# Altium schematic sheet UART_CH340E.SchDoc
size A4
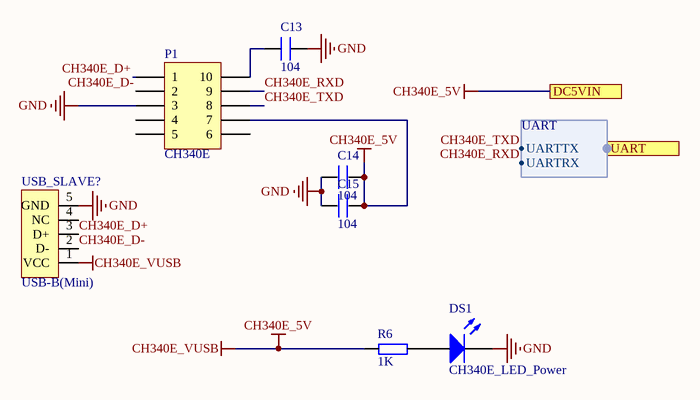
[diagram p0: UART_CH340E.SchDoc]

## Parts
C13  104  [0603P]
C14  104  [0603P]
C15  104  [0603P]
DS1  CH340E_LED_Power  [SMDLED-0603]
P1  CH340E  [SOP10]
R6  1K  [0603P]
USB_SLAVE?  USB-B(Mini)  [MICRO-USB]

## Ports
DC5VIN, UART (harness UART)

## Harnesses
UART: UARTTX, UARTRX

## Nets
CH340E_5V: C14.2 C15.2 P1.7 R6.1 USB_SLAVE?.1(VCC) ; port DC5VIN  [also labelled CH340E_VUSB]
GND: C13.2 C14.1 C15.1 DS1.2(K) P1.3 USB_SLAVE?.5(GND)
CH340E_D+: P1.1 USB_SLAVE?.3(D+)
CH340E_D-: P1.2 USB_SLAVE?.2(D-)
CH340E_RXD: P1.9 ; port UART.UARTRX
CH340E_TXD: P1.8 ; port UART.UARTTX
NetC13_1: C13.1 P1.10
NetDS1_1: DS1.1(A) R6.2

Not connected (* = marked no-connect by the designer): P1 4 5 6; USB_SLAVE? 4(NC)

## Library data of the parts
C13-C15 = C
DS1 = LED2: Typical RED, GREEN, YELLOW, AMBER GaAs LED; Published: 8-Jun-2000; LatestRevisionDate: 17-Jul-2002; LatestRevisionNote: Re-released for DXP Platform.; PackageDocument: Feb-2002; PackageReference: 3.2X1.6X1.1; Publisher: Altium Limited
P1 = Header 5X2A: Header, 5-Pin, Dual row; LatestRevisionDate: 17-Jul-2002; LatestRevisionNote: Re-released for DXP Platform.; Publisher: Altium Limited
R6 = R
USB_SLAVE? = USB5